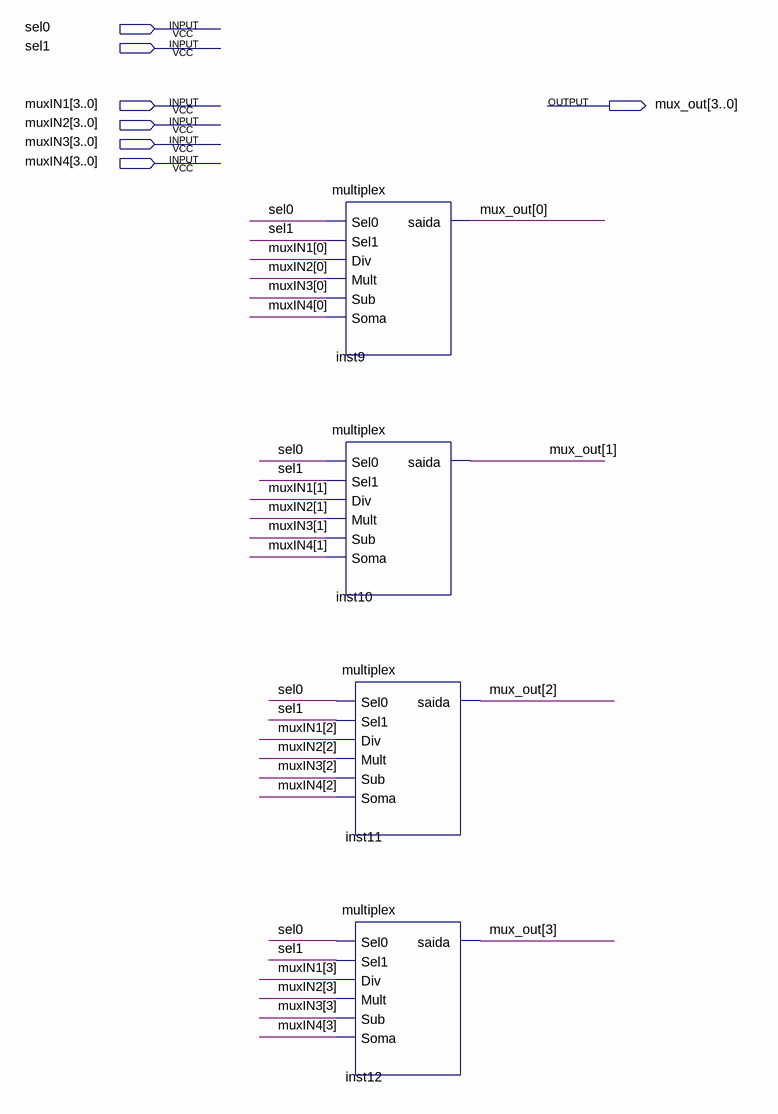
[diagram p0: schematic sheet]
// Quartus schematic mux4x1.bdf as structural Verilog: 4 symbols, 7 pins
module mux4x1 (
  input  sel0,
  input  sel1,
  input  [3:0] muxIN1,
  input  [3:0] muxIN2,
  input  [3:0] muxIN3,
  input  [3:0] muxIN4,
  output [3:0] mux_out
);

  multiplex inst9 (
    .Sel0(sel0), .Sel1(sel1), .Div(muxIN1[0]), .Mult(muxIN2[0]), .Sub(muxIN3[0]), .Soma(muxIN4[0]),
    .saida(mux_out[0]));
  multiplex inst10 (
    .Sel0(sel0), .Sel1(sel1), .Div(muxIN1[1]), .Mult(muxIN2[1]), .Sub(muxIN3[1]), .Soma(muxIN4[1]),
    .saida(mux_out[1]));
  multiplex inst11 (
    .Sel0(sel0), .Sel1(sel1), .Div(muxIN1[2]), .Mult(muxIN2[2]), .Sub(muxIN3[2]), .Soma(muxIN4[2]),
    .saida(mux_out[2]));
  multiplex inst12 (
    .Sel0(sel0), .Sel1(sel1), .Div(muxIN1[3]), .Mult(muxIN2[3]), .Sub(muxIN3[3]), .Soma(muxIN4[3]),
    .saida(mux_out[3]));
endmodule
